# EAGLE design OSSISolarZ (EAGLE 6.1)
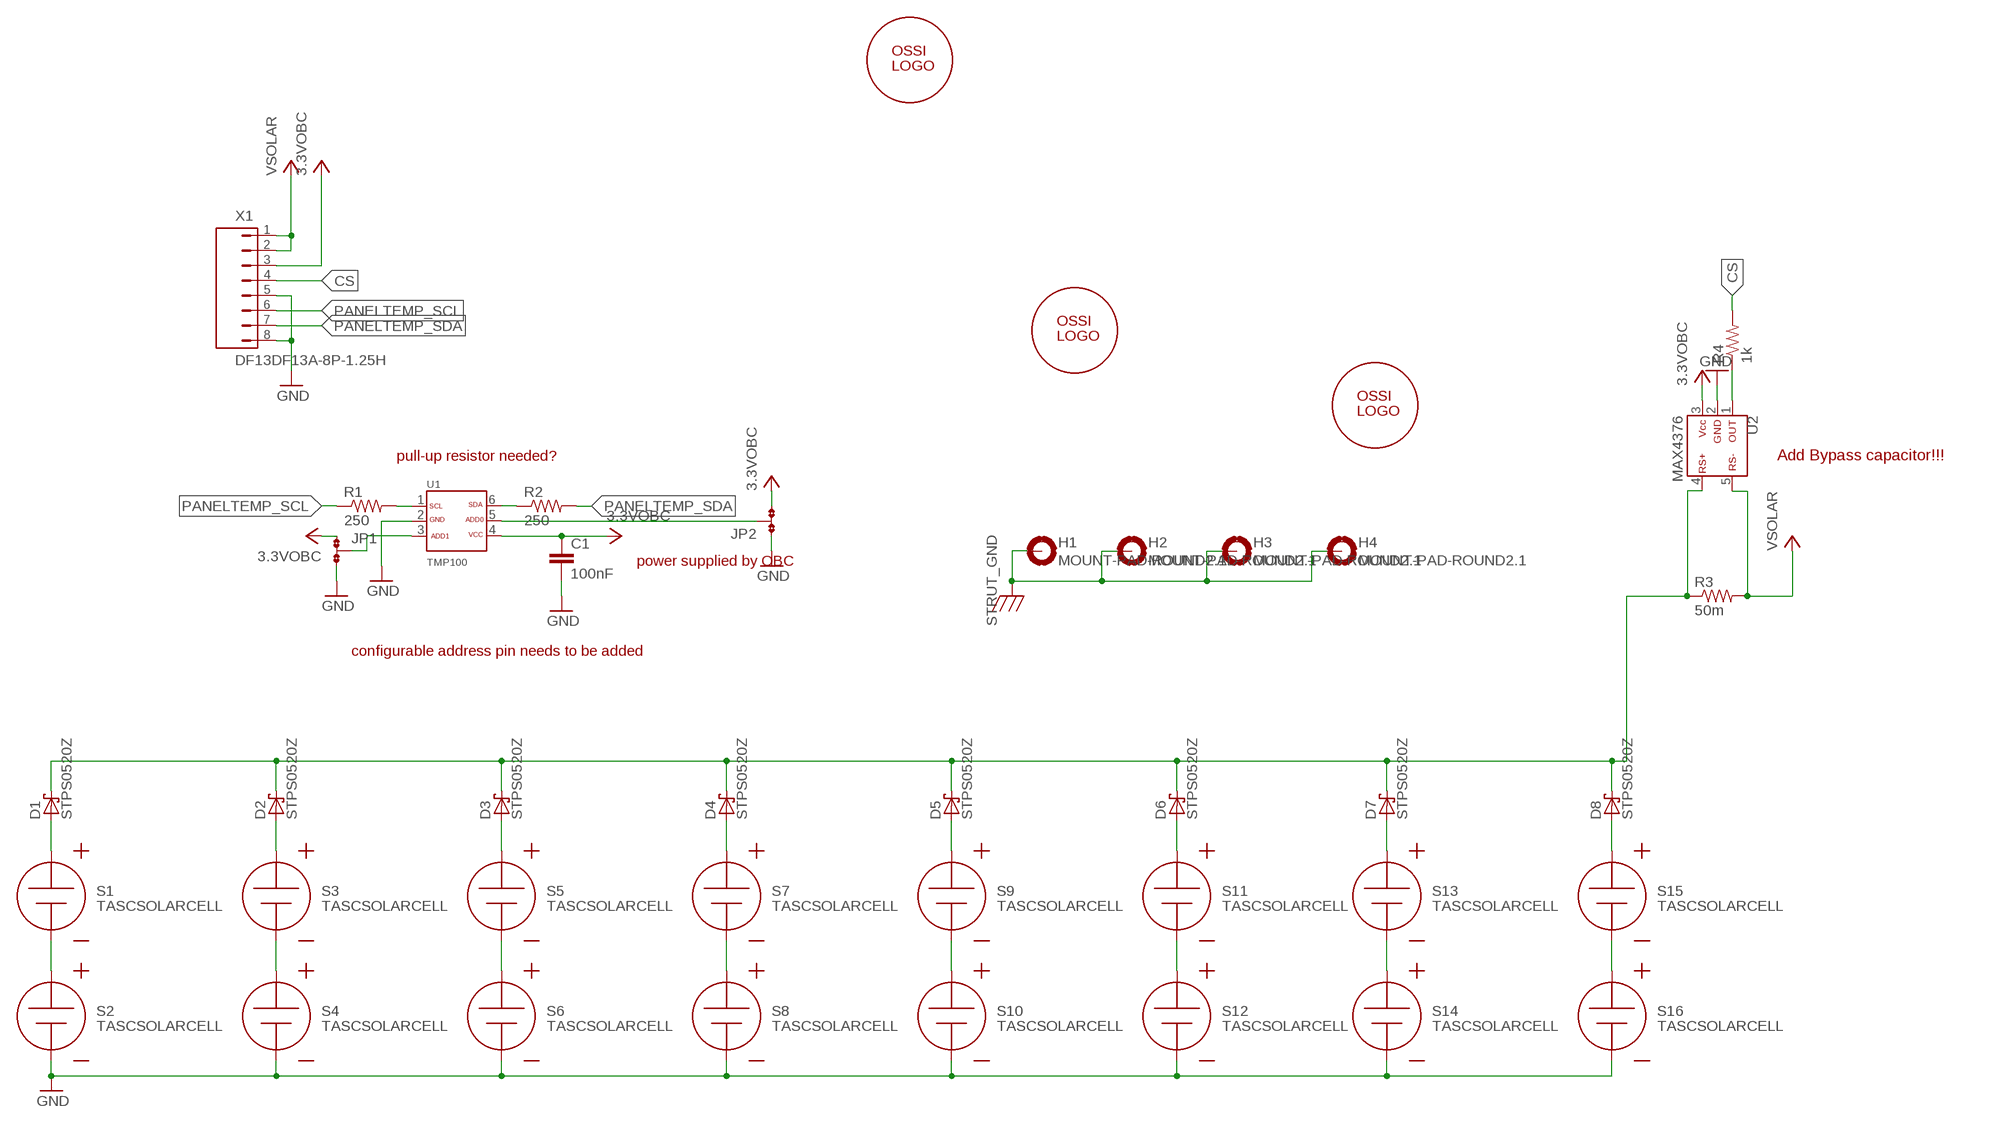
[diagram p0: schematic, sheet 1]

## Parts
C1  100nF  C0603(1608)  [C0603(1608)]
D1  STPS0520Z  [SOD-123]
D2  STPS0520Z  [SOD-123]
D3  STPS0520Z  [SOD-123]
D4  STPS0520Z  [SOD-123]
D5  STPS0520Z  [SOD-123]
D6  STPS0520Z  [SOD-123]
D7  STPS0520Z  [SOD-123]
D8  STPS0520Z  [SOD-123]
H1  MOUNT-PAD-ROUND2.1  [2.1-PAD-ROUND]
H2  MOUNT-PAD-ROUND2.1  [2.1-PAD-ROUND]
H3  MOUNT-PAD-ROUND2.1  [2.1-PAD-ROUND]
H4  MOUNT-PAD-ROUND2.1  [2.1-PAD-ROUND]
JP1  JP2  [JP2SMD0603]
JP2  JP2  [JP2SMD0603]
R1  250  R0603(1608)  [R0603(1608)]
R2  250  R0603(1608)  [R0603(1608)]
R3  50m  RWSL1206  [WSL1206]
R4  1k  R0603(1608)  [R0603(1608)]
S1  TASCSOLARCELL  [TASCSOLARCELL]
S2  TASCSOLARCELL  [TASCSOLARCELL]
S3  TASCSOLARCELL  [TASCSOLARCELL]
S4  TASCSOLARCELL  [TASCSOLARCELL]
S5  TASCSOLARCELL  [TASCSOLARCELL]
S6  TASCSOLARCELL  [TASCSOLARCELL]
S7  TASCSOLARCELL  [TASCSOLARCELL]
S8  TASCSOLARCELL  [TASCSOLARCELL]
S9  TASCSOLARCELL  [TASCSOLARCELL]
S10  TASCSOLARCELL  [TASCSOLARCELL]
S11  TASCSOLARCELL  [TASCSOLARCELL]
S12  TASCSOLARCELL  [TASCSOLARCELL]
S13  TASCSOLARCELL  [TASCSOLARCELL]
S14  TASCSOLARCELL  [TASCSOLARCELL]
S15  TASCSOLARCELL  [TASCSOLARCELL]
S16  TASCSOLARCELL  [TASCSOLARCELL]
U1  TMP100  [SOT23-6DBV]
U2  MAX4376  [SOT23-5DBV]
U$1  OSSILOGO-10  [OSSILOGO1010]
U$2  OSSILOGO-10  [OSSILOGO1010]
U$3  OSSITAGCC  [CCLOGO]
X1  DF13DF13A-8P-1.25H  [DF13A-8P]

## Nets
3.3VOBC: C1.1 JP1.1 JP2.3 U1.4 U2.3 X1.3
CS: R4.2 X1.4
GND: C1.2 JP1.3 JP2.1 S2.N S4.N S6.N S8.N S10.N S12.N S14.N S16.N U1.2 U2.2 X1.5 X1.8
N$1: S1.N S2.P
N$2: D1.A S1.P
N$3: S3.N S4.P
N$4: D2.A S3.P
N$5: S5.N S6.P
N$6: D3.A S5.P
N$7: S7.N S8.P
N$8: D4.A S7.P
N$9: S9.N S10.P
N$10: D5.A S9.P
N$11: S11.N S12.P
N$12: D6.A S11.P
N$13: S13.N S14.P
N$14: D7.A S13.P
N$15: S15.N S16.P
N$16: D8.A S15.P
N$25: R1.2 U1.1
N$26: R2.1 U1.6
N$27: D1.C D2.C D3.C D4.C D5.C D6.C D7.C D8.C R3.P$1 U2.4
N$28: JP1.2 U1.3
N$29: JP2.2 U1.5
N$30: R4.1 U2.1
PANELTEMP_SCL: R1.1 X1.6
PANELTEMP_SDA: R2.2 X1.7
STRUT_GND: H1.B3,2(MOUNT) H2.B3,2(MOUNT) H3.B3,2(MOUNT) H4.B3,2(MOUNT)
VSOLAR: R3.P$2 U2.5 X1.1 X1.2

## Notes on the sheet
- pull-up resistor needed? | Add Bypass capacitor!!!
- power supplied by OBC
- configurable address pin needs to be added

## Library data of the parts
C1 = OSSI:C
D1-D8 = OSSI:STPS0520Z: We use STPS0520Z by st.com diode for solar cell schottky diode. If = 500mA Vrrm = 20V Vf max = 0.32V
H1-H4 = OSSI:MOUNT-PAD-ROUND
JP1 JP2 = OSSI:JP2
R1-R4 = OSSI:R
S1-S16 = OSSI:TASCSOLARCELL
U1 = OSSI:TMP100: TMP100 Digital Temerature Sensor with I2C Interface from Texas Instruments
U2 = OSSI:MAX4376
U$1 U$2 = OSSI:OSSILOGO
U$3 = OSSI:OSSITAG
X1 = OSSI:DF13: Hirose DF13 series connector

## Board
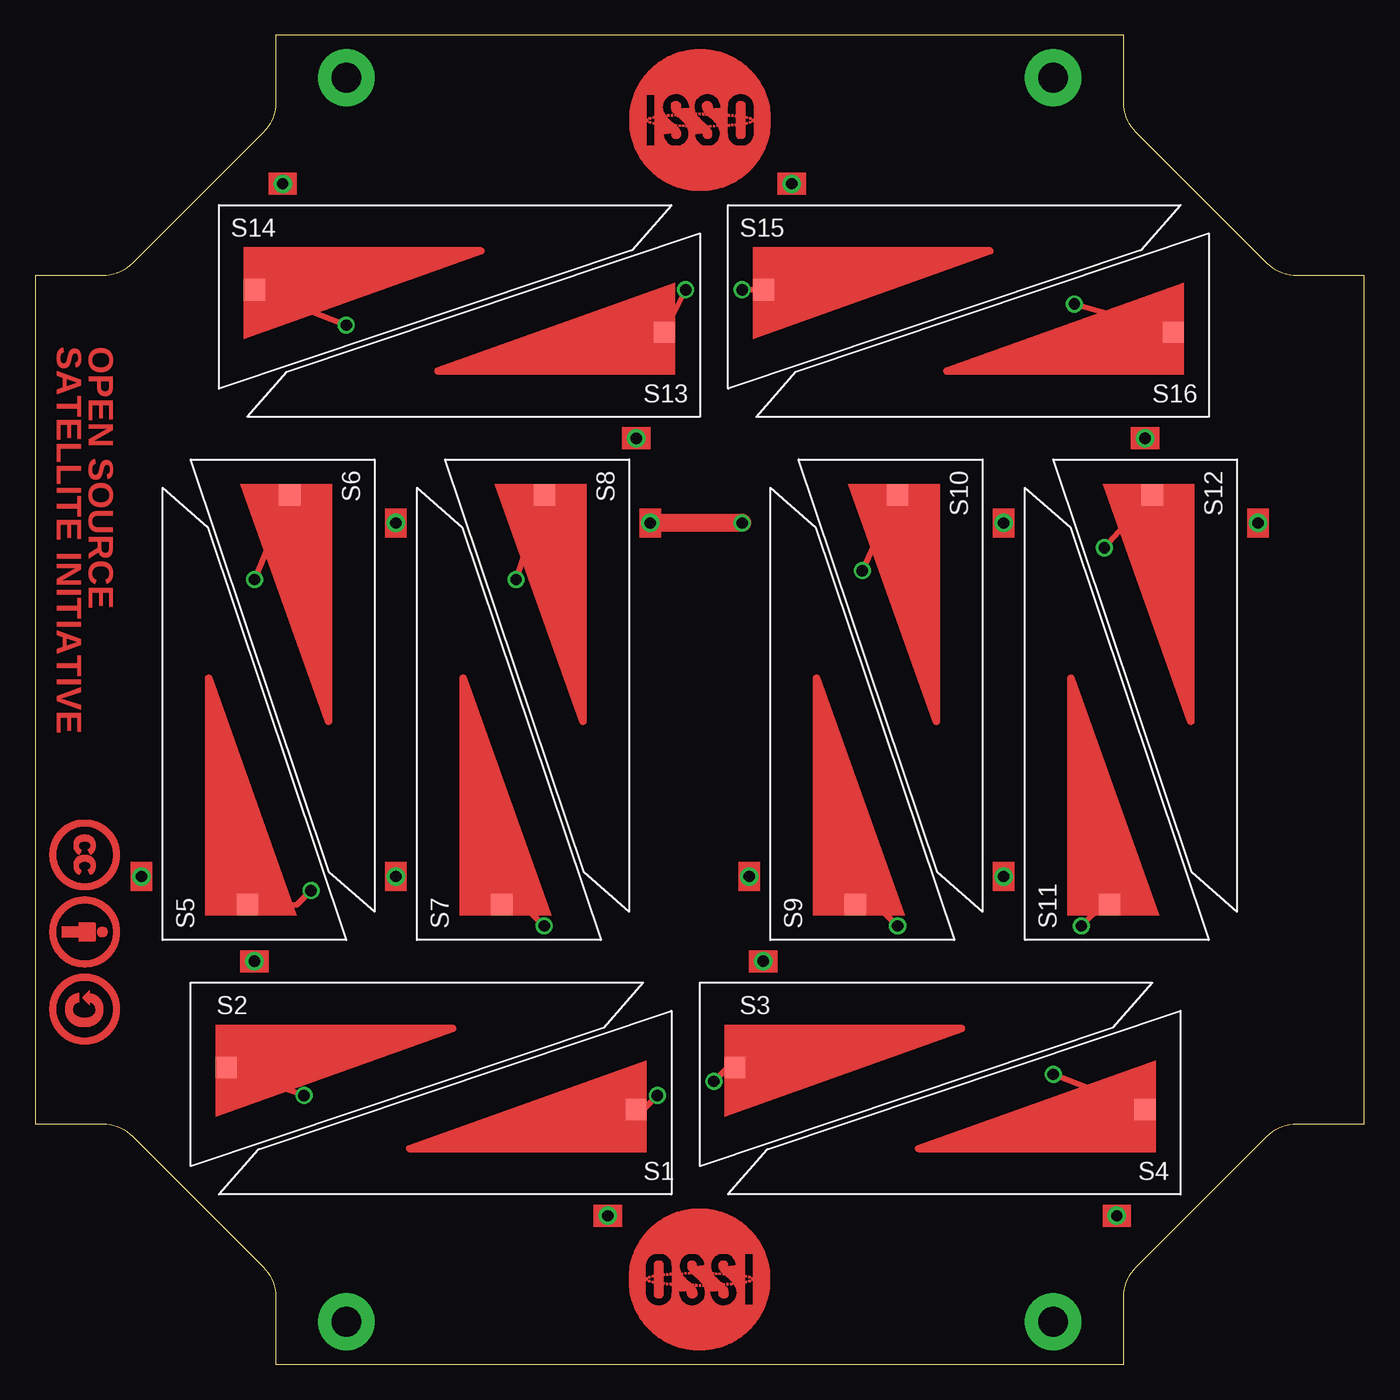
[diagram p1: board, top side]
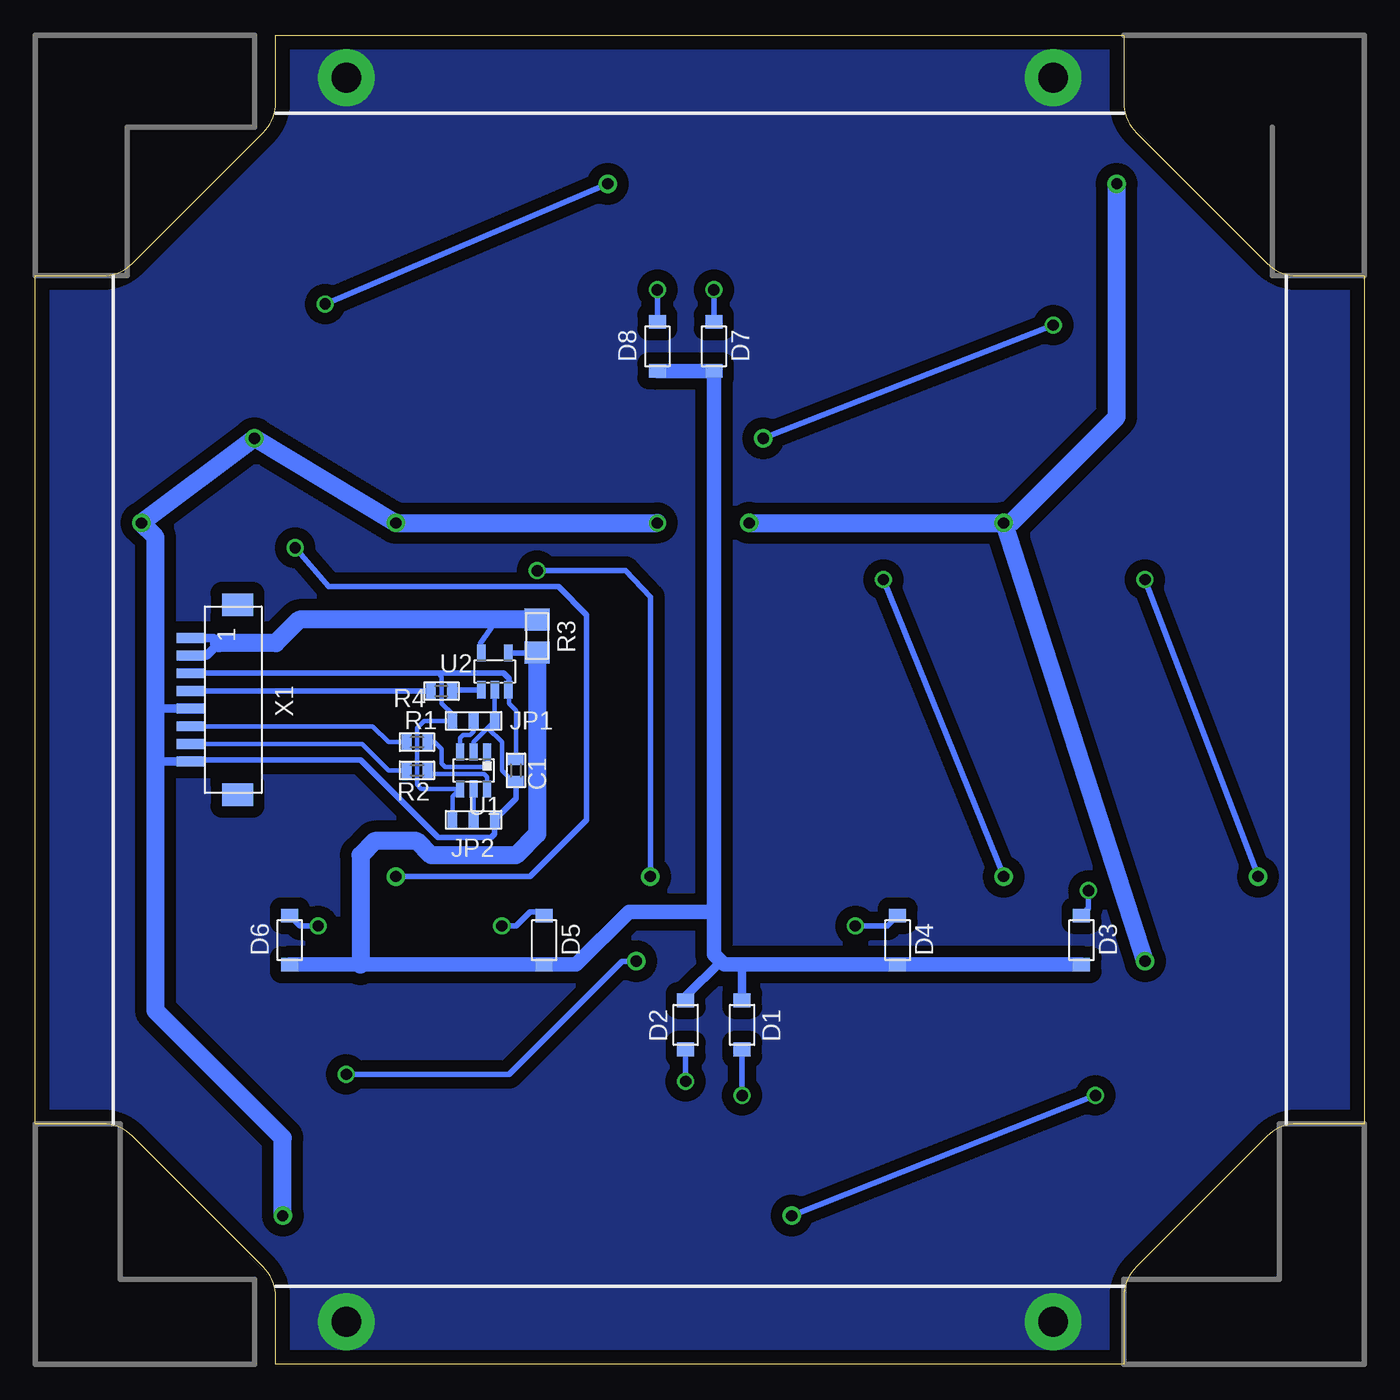
[diagram p2: board, bottom side, seen from below]

Size 94 x 94 mm. Coordinates in mm from the lower left corner, seen from the top.
Outline: 17,0 77,0 77,4.76 arc-45 77.88,6.88 87.12,16.12 arc-45 89.24,17 94,17 94,77 89.24,77 arc-45 87.12,77.88 77.88,87.12 arc-45 77,89.24 77,94 17,94 17,89.24 arc-45 16.12,87.12 6.88,77.88 arc-45 4.76,77 0,77 0,17 4.76,17 arc-45 6.88,16.12 16.12,6.88 arc-45 17,4.76 17,0
Copper layers (1*16): Top 0.035mm / dielectric 1.5mm / Bottom 0.035mm
Design rules "default": minimum track width 10mil, minimum drill 24mil, track to track 8mil, track to pad 8mil, pad to pad 8mil, via to via 8mil, smd to smd 8mil, copper to edge 40mil, drill to drill 8mil, minimum pad ring 10mil, minimum via ring 8mil, stop-mask expansion 4mil, vias tented up to drill 0mil, thermal gap 10mil

### Footprints (pad centres in the part's own frame; a part is rotated, then mirrored left to right if it is on the bottom)
C0603(1608) = smd 0.7 x 1.1: 1 -0.75,0; 2 0.75,0
SOD-123 = smd 0.97 x 1.2: A -1.735,0; C 1.735,0
2.1-PAD-ROUND = drill 2.1 pad 4: B3,2 0,0
JP2SMD0603 = smd 0.7 x 1.1: 1 -1.5,0; 2 0,0; 3 1.5,0
R0603(1608) = smd 0.7 x 1.1: 1 -0.75,0; 2 0.75,0
WSL1206 = smd 1.57 x 1.78: P$1 -1.165,0; P$2 1.165,0
TASCSOLARCELL = drill 0.8: N -4.5,-1.5 | smd 1.5 x 1.5: P -2.5,6
SOT23-6DBV = smd 0.55 x 1.2: 1 -0.95,-1.3; 2 0,-1.3; 3 0.95,-1.3; 4 0.95,1.3; 5 0,1.3; 6 -0.95,1.3
SOT23-5DBV = smd 0.6 x 1.22: 1 -0.95,-1.3; 2 0,-1.3; 3 0.95,-1.3; 4 0.95,1.3; 5 -0.95,1.3
DF13A-8P = smd 0.7 x 2: 1 -4.375,0; 2 -3.125,0; 3 -1.875,0; 4 -0.625,0; 5 0.625,0; 6 1.875,0; 7 3.125,0; 8 4.375,0 | smd 1.6 x 2.2: P$1 -6.725,3.3; P$2 6.725,3.3

### Placement (x,y rotation side)
C1  60,42 270 bottom
D1  44,24 90 bottom
D2  48,24 90 bottom
D3  20,30 270 bottom
D4  33,30 270 bottom
D5  58,30 270 bottom
D6  76,30 270 bottom
D7  46,72 270 bottom
D8  50,72 270 bottom
H1  22,91 0 top
H2  72,91 0 top
H3  22,3 0 top
H4  72,3 0 top
JP1  63,45.5 0 bottom
JP2  63,38.5 180 bottom
R1  67,44 0 bottom
R2  67,42 180 bottom
R3  58.5,51.5 90 bottom
R4  65.27,47.61 180 bottom
S1  45,12 0 top
S2  11,27 180 top
S3  47,27 180 top
S4  81,12 0 top
S5  9,30 270 top
S6  24,64 90 top
S7  27,30 270 top
S8  42,64 90 top
S9  52,30 270 top
S10  67,64 90 top
S11  70,30 270 top
S12  85,64 90 top
S13  47,67 0 top
S14  13,82 180 top
S15  49,82 180 top
S16  83,67 0 top
U1  63,42 180 bottom
U2  61.5,49 0 bottom
U$1  47,6 0 top
U$2  47,88 180 top
U$3  1,38.5 270 top
X1  83,47 270 bottom

### Tracks (layer width: path | path; a pad name or v marks a point on that pad's centre or on a via)
3.3VOBC
  Bottom 0.305: JP2.3 64.5,40.15 U1.4 66.7,40.7 67,41 67,45 66.5,45.5 JP1.1 64.5,46 65.25,46.75 65.25,48.62 65.5,48.88 | C1.1 60,46.25 60.5,46.75 60.5,47.65 U2.3
  Bottom 0.406: X1.3 65.5,48.88 60.88,48.88 60.5,48.5 60.5,47.75 U2.3
CS
  Bottom 0.406: R4.2 82.98,47.61 X1.4
GND  (via drill 0.8)
  Top 1.27: v50,59.5 S8.N
  Bottom 0.305: U1.2 63,44 62,45 | 62,45 JP1.3 U2.2 | C1.2 60.25,41.25 61,42 61,44 62,45
  Bottom 0.406: C1.2 60,40 JP2.1 61.5,37.5 61.75,37.25 65.5,37.25 71,42.75 83.5,42.75 83.5,42.62
  Bottom 0.61: X1.8 83.5,42.62 85.38,42.62 85.5,42.5 | X1.5 85.12,46.38 85.5,46
  Bottom 1.27: v50,59.5 S10.N S16.N S12.N 85.5,58.5 85.5,46 85.5,42.5 85.5,25 76.5,16 S4.N | S8.N S6.N | S6.N 25,59.5 17.5,67 S14.N | S6.N S2.N
N$1  (via drill 0.8)
  Top 0.406: S2.P v19,19
  Bottom 0.406: v19,19 S1.N
N$2  (via drill 0.8)
  Top 0.406: S1.P 43,18 v44,19
  Bottom 0.406: v44,19 D1.A
N$3  (via drill 0.8)
  Top 0.406: S4.P v72,20.5
  Bottom 0.406: v72,20.5 60.5,20.5 52.5,28.5 S3.N
N$4  (via drill 0.8)
  Top 0.406: S3.P 49,21 v48,20
  Bottom 0.406: v48,20 D2.A
N$5  (via drill 0.8)
  Top 0.406: S6.P v15.5,55.5
  Bottom 0.406: v15.5,55.5 S5.N
N$6  (via drill 0.8)
  Top 0.406: S5.P 18.5,32.5 v19.5,33.5
  Bottom 0.406: v19.5,33.5 19.5,32.23 D3.A
N$7  (via drill 0.8)
  Top 0.406: S8.P v34,55.5
  Bottom 0.406: v34,55.5 S7.N
N$8  (via drill 0.8)
  Top 0.406: S7.P 34.5,32.5 v36,31
  Bottom 0.406: v36,31 33.73,31 D4.A
N$9  (via drill 0.8)
  Top 0.406: S10.P v58.5,56.12
  Bottom 0.406: v58.5,56.12 52.25,56.12 50.5,54.25 S9.N
N$10  (via drill 0.8)
  Top 0.406: S9.P 59.5,32.5 v61,31
  Bottom 0.406: v61,31 60,31 59,32 58.27,32 D5.A
N$11  (via drill 0.8)
  Top 0.406: S12.P v75.62,57.75
  Bottom 0.406: v75.62,57.75 73.25,55 57,55 55,53 55,38.5 59,34.5 S11.N
N$12  (via drill 0.8)
  Top 0.406: S11.P 75.5,32.5 v74,31
  Bottom 0.406: v74,31 75.27,31 D6.A
N$13  (via drill 0.8)
  Top 0.406: S14.P v22,73.5
  Bottom 0.406: v22,73.5 S13.N
N$14  (via drill 0.8)
  Top 0.406: S13.P v46,76
  Bottom 0.406: v46,76 D7.A
N$15  (via drill 0.8)
  Top 0.406: S16.P v73.5,75
  Bottom 0.406: v73.5,75 S15.N
N$16  (via drill 0.8)
  Top 0.406: S15.P v50,76
  Bottom 0.406: v50,76 D8.A
N$25
  Bottom 0.305: R1.2 65.75,44 65.25,43.5 65.25,42.5 65,42.25 62.25,42.25 62,42.5 62,43.25 U1.1
N$26
  Bottom 0.305: U1.6 62.05,41.55 62.25,41.75 66,41.75 R2.1
N$27
  Bottom 0.406: U2.4 59.3,50.3 59,50 | 58,50 59,50 | R3.P$1 58.66,50.34 59,50
  Bottom 0.61: 45.27,28.27 45.5,28.5 48,26 D2.C | D1.C 44,28.27
  Bottom 1.016: D3.C D4.C 44,28.27 45.27,28.27 | 45.5,28.5 46,29 46,32 | 46,32 D7.C D8.C | D6.C 71,28.27 D5.C 55.73,28.27 52,32 46,32
  Bottom 1.27: R3.P$1 58.5,37.5 60,36 66,36 67,37 70,37 71,36 71,28.27
N$28
  Bottom 0.305: U1.3 63.95,44.3 63.75,44.5 63.25,44.5 63,44.75 JP1.2
N$29
  Bottom 0.305: JP2.2 U1.5
N$30
  Bottom 0.406: U2.1 64.43,47.7 R4.1
PANELTEMP_SCL
  Bottom 0.305: X1.6 70.12,45.12 69,44 R1.1 | R1.1
PANELTEMP_SDA
  Bottom 0.305: X1.7 70.88,43.88 69,42 R2.2 | R2.2
STRUT_GND
  pour Bottom (isolate 0.813, no thermals): 17,94 17,89 5,77 0,77 0,17 5,17 17,5 17,0 77,0 77,5 89,17 94,17 94,77 89,77 77,89 77,94
VSOLAR
  Bottom 0.406: R3.P$2 61.34,52.66 62.5,51 62.5,50.35 U2.5
  Bottom 0.61: X1.1 81.38,51.38 81,51 81.88,50.12 X1.2
  Bottom 1.27: R3.P$2 75.33,52.66 77,51 81,51

### Text on the board
Top: SATELLITE INITIATIVE | OPEN SOURCE
tStop: SATELLITE INITIATIVE | OPEN SOURCE